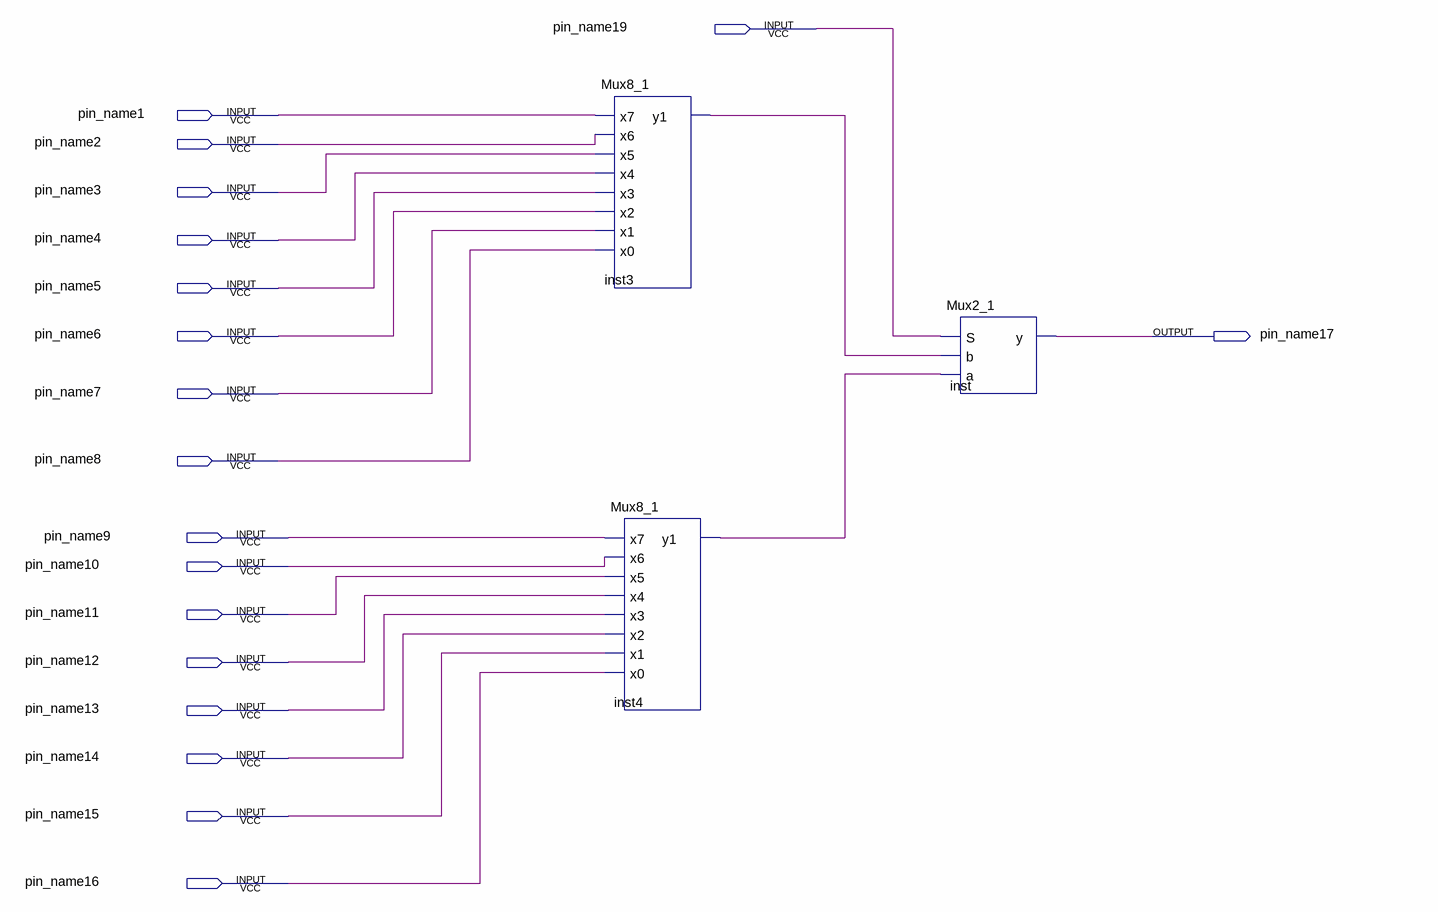
[diagram p0: schematic sheet]
// Quartus schematic Mux16_1.bdf as structural Verilog: 3 symbols, 18 pins
module Mux16_1 (
  input  pin_name19,
  input  pin_name1,
  input  pin_name2,
  input  pin_name3,
  input  pin_name4,
  input  pin_name5,
  input  pin_name6,
  input  pin_name7,
  input  pin_name8,
  input  pin_name9,
  input  pin_name10,
  input  pin_name11,
  input  pin_name12,
  input  pin_name13,
  input  pin_name14,
  input  pin_name15,
  input  pin_name16,
  output pin_name17
);

  wire inst3_y1, inst4_y1;

  Mux8_1 inst3 (
    .x7(pin_name1), .x6(pin_name2), .x5(pin_name3), .x4(pin_name4), .x3(pin_name5), .x2(pin_name6),
    .x1(pin_name7), .x0(pin_name8), .y1(inst3_y1));
  Mux8_1 inst4 (
    .x7(pin_name9), .x6(pin_name10), .x5(pin_name11), .x4(pin_name12), .x3(pin_name13), .x2(pin_name14),
    .x1(pin_name15), .x0(pin_name16), .y1(inst4_y1));
  Mux2_1 inst (.S(pin_name19), .b(inst3_y1), .a(inst4_y1), .y(pin_name17));
endmodule
